# EAGLE design SmartLamp (EAGLE 7.7.0)
VERSION: 1.0
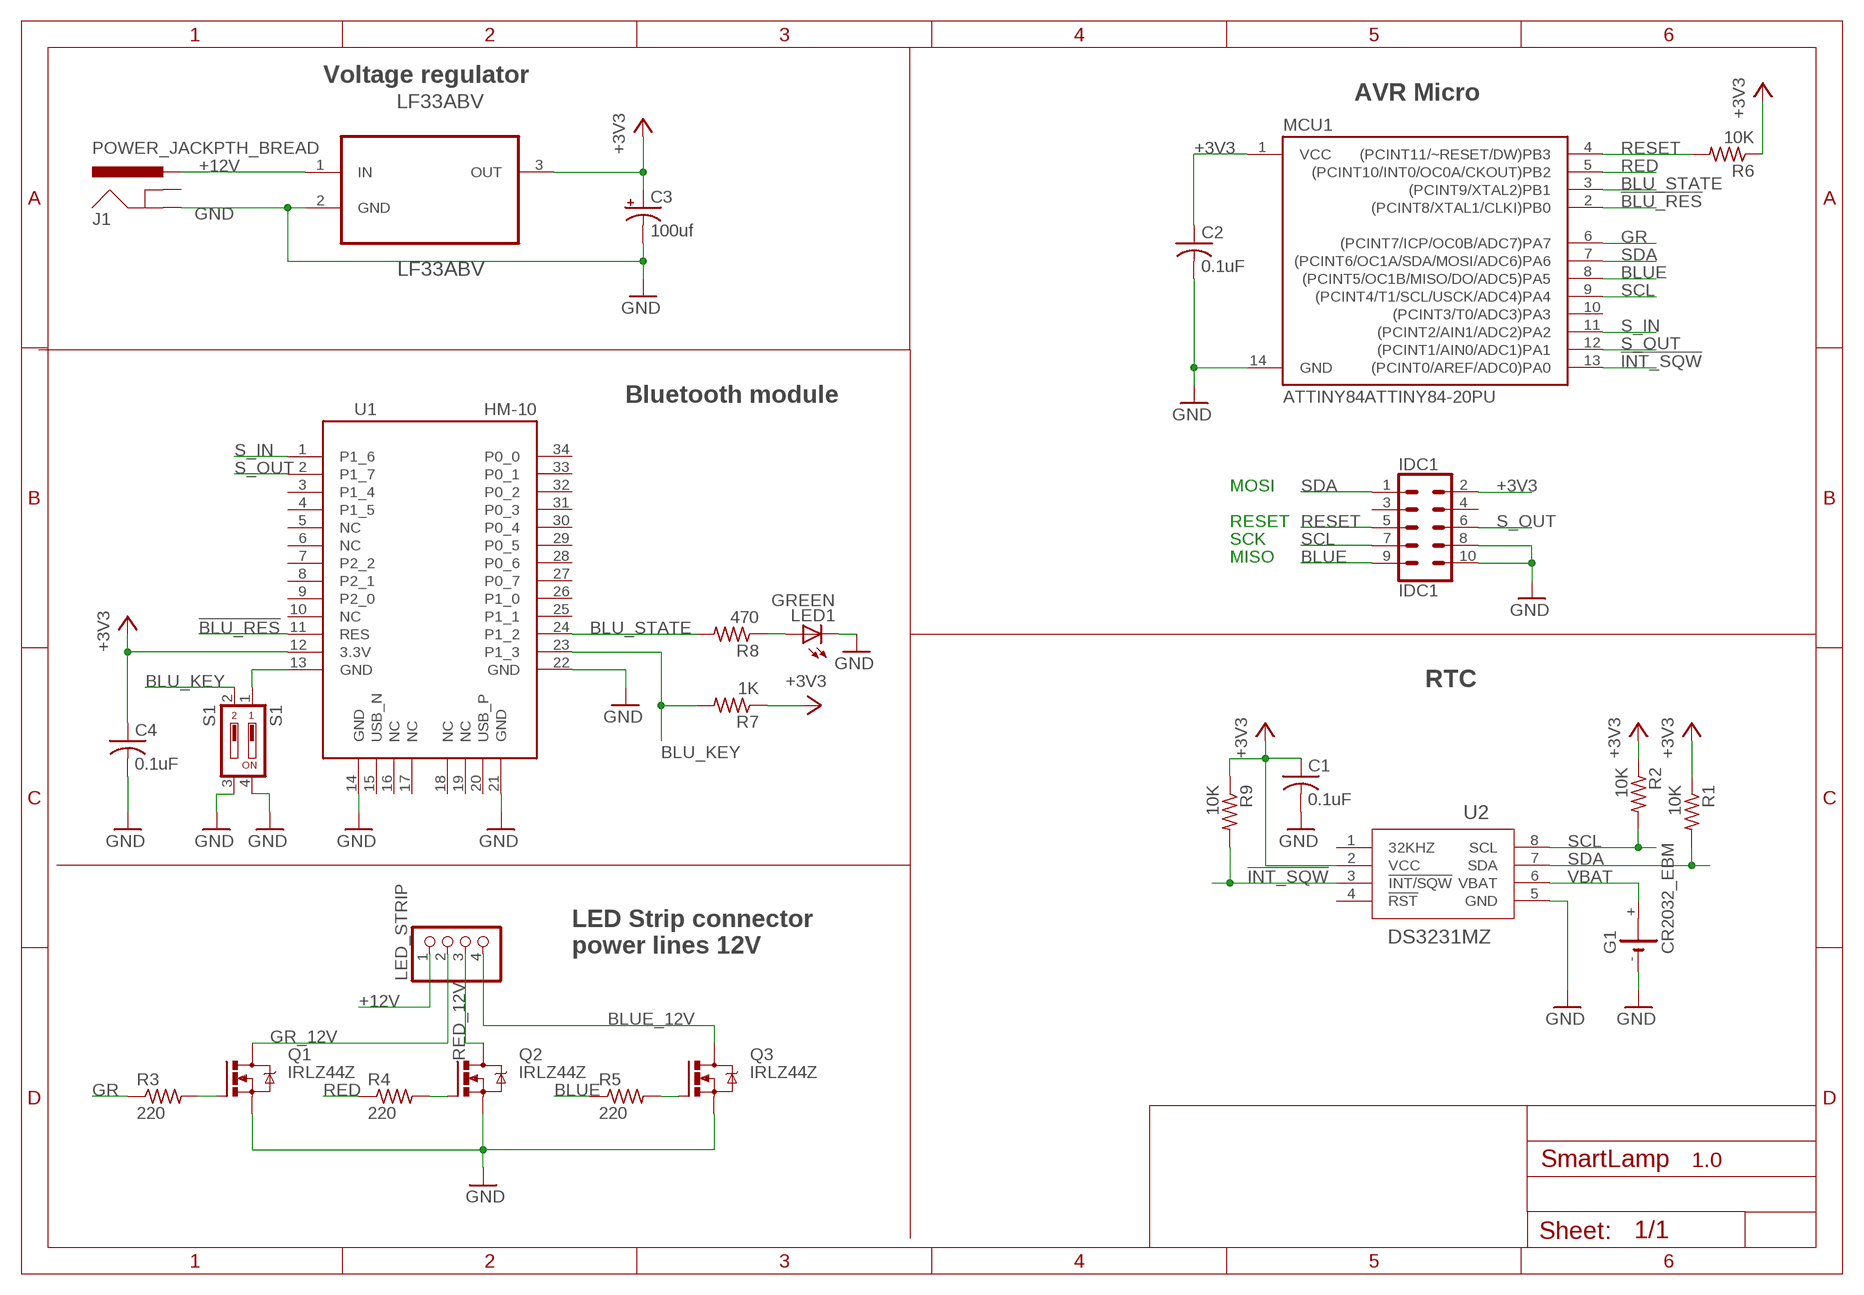
[diagram p0: schematic, sheet 1]

## Parts
C1  0.1uF  C-US025-024X044  [C025-024X044]
C2  0.1uF  C-US025-024X044  [C025-024X044]
C3  100uf  CAP_POLPTH2  [CPOL-RADIAL-10UF-25V]
C4  0.1uF  C-US025-024X044  [C025-024X044]
G1  CR2032_EBM  [CR2032_EBM]
IDC1  IDC1  CONN_05X2SHD  [2X5-SHROUDED]
J1  POWER_JACKPTH_BREAD  [POWER_JACK_PTH_BREAD]
LED1  GREEN  LED3MM  [LED3MM]
LED_STRIP  PINHD-1X4  [1X04]
LF33ABV  LF33ABV  [TO254P450X1020X1935-3P]
MCU1  ATTINY84ATTINY84-20PU  [DIL14]
Q1  IRLZ44Z  [TO220BH]
Q2  IRLZ44Z  [TO220BH]
Q3  IRLZ44Z  [TO220BH]
R1  10K  R-US_0309/12  [0309/12]
R2  10K  R-US_0309/12  [0309/12]
R3  220  R-US_0207/10  [0207/10]
R4  220  R-US_0207/10  [0207/10]
R5  220  R-US_0207/10  [0207/10]
R6  10K  R-US_0309/12  [0309/12]
R7  1K  R-US_0207/10  [0207/10]
R8  470  R-US_0309/12  [0309/12]
R9  10K  R-US_0309/12  [0309/12]
S1  S1  SD4-02  [SD4-02]
U1  HM-10  [HM-10]
U2  DS3231MZ  [21-0041B_8]

## Nets
!BLU_RES: MCU1.2((PCINT8/XTAL1/CLKI)PB0) U1.11(RES)
!INT_SQW: MCU1.13((PCINT0/AREF/ADC0)PA0) R9.2 U2.3(!INT/SQW)
+3V3 [3.3V]: C1.1 C2.1 C3.1(+) C4.1 IDC1.2 LF33ABV.3(OUT) MCU1.1(VCC) R1.1 R2.1 R6.1 R7.1 R9.1 U1.12(3.3V) U2.2(VCC)
+12V [POWER]: J1.PWR LED_STRIP.1 LF33ABV.1(IN)
BLU_KEY: R7.2 S1.2 U1.23(P1_3)
BLU_STATE: MCU1.3((PCINT9/XTAL2)PB1) R8.2 U1.24(P1_2)
BLU_SWITCH: S1.1 U1.13(GND)
BLUE: IDC1.9 MCU1.8((PCINT5/OC1B/MISO/DO/ADC5)PA5) R5.1
BLUE_12V [POWER]: LED_STRIP.4 Q3.D
GND [POWER]: C1.2 C2.2 C3.2(-) C4.2 G1.- IDC1.8 IDC1.10 J1.GND LED1.K(C) LF33ABV.2(GND) MCU1.14(GND) Q1.S Q2.S Q3.S S1.3 S1.4 U1.14(GND) U1.21(GND) U1.22(GND) U2.5(GND)
GR: MCU1.6((PCINT7/ICP/OC0B/ADC7)PA7) R3.1
GR_12V [POWER]: LED_STRIP.2 Q1.D
N$7: Q1.G R3.2
N$8: Q2.G R4.2
N$10: LED1.A R8.1
N$11: Q3.G R5.2
RED: MCU1.5((PCINT10/INT0/OC0A/CKOUT)PB2) R4.1
RED_12V [POWER]: LED_STRIP.3 Q2.D
RESET: IDC1.5 MCU1.4((PCINT11/~RESET/DW)PB3) R6.2
S_IN: MCU1.11((PCINT2/AIN1/ADC2)PA2) U1.1(P1_6)
S_OUT: IDC1.6 MCU1.12((PCINT1/AIN0/ADC1)PA1) U1.2(P1_7)
SCL: IDC1.7 MCU1.9((PCINT4/T1/SCL/USCK/ADC4)PA4) R2.2 U2.8(SCL)
SDA: IDC1.1 MCU1.7((PCINT6/OC1A/SDA/MOSI/ADC6)PA6) R1.2 U2.7(SDA)
VBAT: G1.+ U2.6(VBAT)
Unconnected: IDC1.3 IDC1.4 J1.GNDBREAK MCU1.10((PCINT3/T0/ADC3)PA3) U1.3(P1_4) U1.4(P1_5) U1.5(NC) U1.6(NC) U1.7(P2_2) U1.8(P2_1) U1.9(P2_0) U1.10(NC) U1.15(USB_N) U1.16(NC) U1.17(NC) U1.18(NC) U1.19(NC) U1.20(USB_P) U1.25(P1_1) U1.26(P1_0) U1.27(P0_7) U1.28(P0_6) U1.29(P0_5) U1.30(P0_4) U1.31(P0_3) U1.32(P0_2) U1.33(P0_1) U1.34(P0_0) U2.1(32KHZ) U2.4(!RST)

## Notes on the sheet
- Voltage regulator
- AVR Micro
- Bluetooth module
- MOSI
- RESET
- SCK
- MISO
- RTC
- LED Strip connector
  power lines 12V

## Library data of the parts
C1 C2 C4 = adafruit:C-US: CAPACITOR, American symbol
C3 = SparkFun-Capacitors:CAP_POL: Capacitor Polarized These are standard SMD and PTH capacitors. Normally 10uF, 47uF, and 100uF in electrolytic and tantalum varieties. Always verify the external diameter of the through hole cap, it varies with capacity, voltage, and manufacturer. The EIA devices should be standard.
G1 = CuSTOM_GB:CR2032_EBM: Battery holder CR2032 from EbmStore
IDC1 = SparkFun-Connectors:CONN_05X2: Multi connection point. Often used as Generic Header-pin footprint for 0.1 inch spaced/style header connections For AVR SPI programming port, see special device with nice symbol: "AVR_SPI_PROG_5x2.dev" You can populate with any combo of single row headers, but if you'd like an exact match, check these: 2x5 AVR ICSP Male Header <https://www.sparkfun.com/products/778> (PRT-00778) 2x5 Pin Shrouded Header <https://www.sparkfun.com/products/8506> (PRT-08506) On any of the 0.1 inch spaced packages, you can populate with these: Break Away Headers - Straight <https://www.sparkfun.com/products/116> (PRT-00116) Break Away Male Headers - Right Angle <https://www.sparkfun.com/products/553> (PRT-00553) Female Headers <https://www.sparkfun.com/products/115> (PRT-00115) Break Away Headers - Machine Pin <https://www.sparkfun.com/products/117> (PRT-00117) Break Away Female Headers - Swiss Machine Pin <https://www.sparkfun.com/products/743> (PRT-00743) Special note: the shrouded connector mates well with our 5x2 ribbon cables: 2x5 Pin IDC Ribbon Cable <https://www.sparkfun.com/products/8535> (PRT-08535); PROD_ID: CONN-08671; SF_ID: PRT-08506
J1 = SparkFun-Connectors:POWER_JACK: Power Jack Connector This is the standard 5.5mm barrel jack for power. The PTH is the most common, proven, reliable, footprint. The Slot footprint only works if the mill layer is transmitted to the PCB fab house so be warned. Here are the connectors we sell at SparkFun: DC Barrel Power Jack/Connector <https://www.sparkfun.com/products/119> (PRT-00119) DC Barrel Power Jack/Connector (SMD) <https://www.sparkfun.com/products/12748> (PRT-12748) DC Barrel Jack Adapter - Breadboard Compatible <https://www.sparkfun.com/products/10811> (PRT-10811) It is used on this SparkFun product (and many, many others): SparkFun RedBoard - Programmed with Arduino <https://www.sparkfun.com/products/12757> (DEV-12757) Also, if you need a mating power supply or connector, please check these out: Wall Adapter Power Supply - 9VDC 650mA <https://www.sparkfun.com/products/298> (TOL-00298) DC Barrel Jack Adapter - Male <https://www.sparkfun.com/products/10287> (PRT-10287); PROD_ID: PRT-10811
LED1 = adafruit:LED: LED OSRAM: - CHIPLED LG R971, LG N971, LY N971, LG Q971, LY Q971, LO R971, LY R971 LH N974, LH R974 LS Q976, LO Q976, LY Q976 LO Q996 - Hyper CHIPLED LW Q18S LB Q993, LB Q99A, LB R99A - SideLED LS A670, LO A670, LY A670, LG A670, LP A670 LB A673, LV A673, LT A673, LW A673 LH A674 LY A675 LS A676, LA A676, LO A676, LY A676, LW A676 LS A679, LY A679, LG A679 - Hyper Micro SIDELED® LS Y876, LA Y876, LO Y876, LY Y876 LT Y87S - SmartLED LW L88C, LW L88S LB L89C, LB L89S, LG L890 LS L89K, LO L89K, LY L89K LS L896, LA L896, LO L896, LY L896 - TOPLED LS T670, LO T670, LY T670, LG T670, LP T670 LSG T670, LSP T670, LSY T670, LOP T670, LYG T670 LG T671, LOG T671, LSG T671 LB T673, LV T673, LT T673, LW T673 LH T674 LS T676, LA T676, LO T676, LY T676, LB T676, LH T676, LSB T676, LW T676 LB T67C, LV T67C, LT T67C, LS T67K, LO T67K, LY T67K, LW E67C LS E67B, LA E67B, LO E67B, LY E67B, LB E67C, LV E67C, LT E67C LW T67C LS T679, LY T679, LG T679 LS T770, LO T770, LY T770, LG T770, LP T770 LB T773, LV T773, LT T773, LW T773 LH T774 LS E675, LA E675, LY E675, LS T675 LS T776, LA T776, LO T776, LY T776, LB T776 LHGB T686 LT T68C, LB T68C - Hyper Mini TOPLED® LB M676 - Mini TOPLED Santana® LG M470 LS M47K, LO M47K, LY M47K Source: http://www.osram.convergy.de/
LED_STRIP = pinhead:PINHD-1X4: PIN HEADER
LF33ABV = ST Microelctronics_By_element14_Batch_1:LF33ABV: Very low drop voltage regulators with inhibit; MPN: LF33ABV; OC_FARNELL: 1087184; OC_NEWARK: 26M0228; PACKAGE: TO-220; SUPPLIER: STMicroelectronics
MCU1 = SparkFun-DigitalIC:ATTINY84: Atmel 14-pin 2/4/8kB flash uC
Q1-Q3 = transistor-power:IRLZ44Z: N-Channel HEXFET® Power MOSFET Logic Level AUTOMOTIVE MOSFET Source: http://www.irf.com/product-info/datasheets/data/irlz44zpbf.pdf
R1-R9 = rcl:R-US_: RESISTOR, American symbol
S1 = switch-dil:SD4-02: DIL/CODE SWITCH; OC_FARNELL: unknown; OC_NEWARK: unknown
U1 = HM-10_BLE:HM-10
U2 = Maxim_RTC:DS3231MZ; MANUFACTURER_PART_NUMBER: DS3231MZ; VENDOR: MAXIM

## Net classes
1 POWER: width 0.762 mm, drill 0.508 mm, clearance 0.381 mm
2 3.3V: width 0.127 mm, drill 0.127 mm, clearance 0.254 mm

## Board
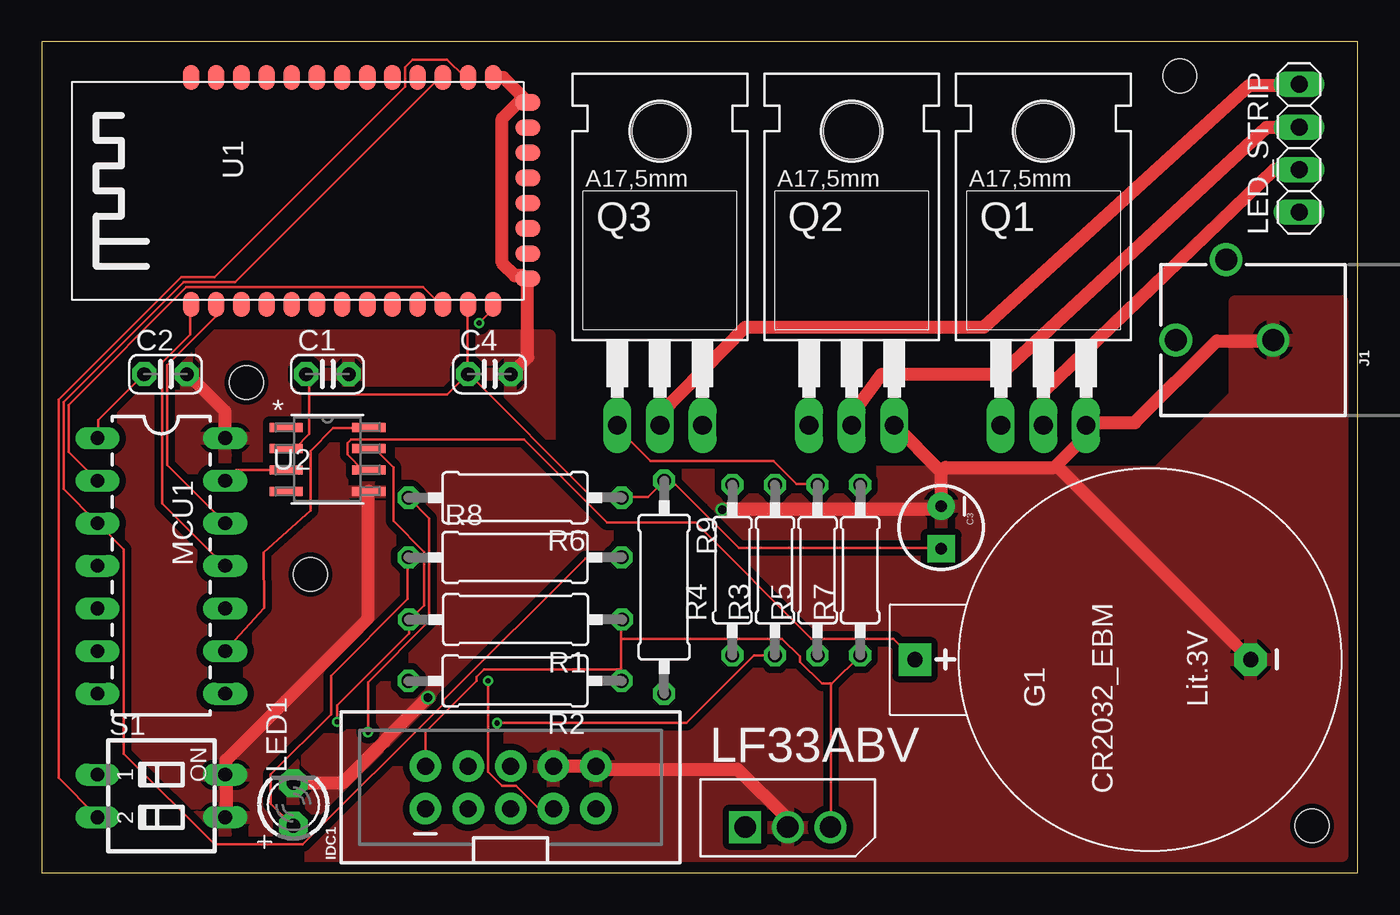
[diagram p1: board, top side]
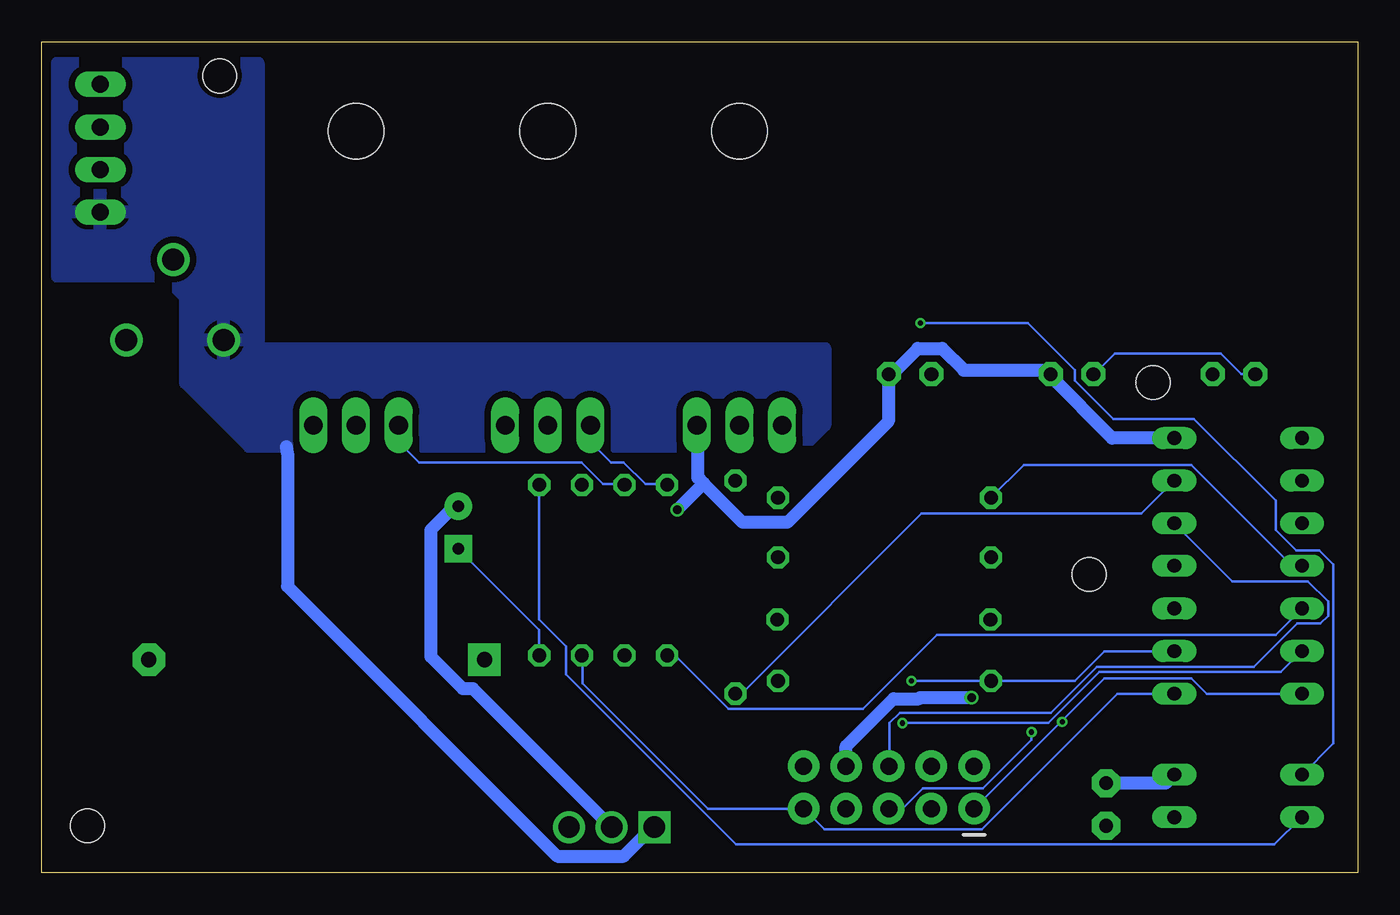
[diagram p2: board, bottom side, seen from below]

Size 78.41 x 49.52 mm. Coordinates in mm from the lower left corner, seen from the top.
Outline: 0,0 78.41,0 78.41,49.52 0,49.52 0,0
Copper layers (1*16): Top 0.035mm / dielectric 1.5mm / Bottom 0.035mm
Design rules "SeeedStudio_2layer_DRU_no_angle_20140221": minimum track width 6mil, minimum drill 12mil, track to track 6mil, track to pad 6mil, pad to pad 6mil, via to via 6mil, smd to smd 0mil, copper to edge 10mil, drill to drill 10mil, minimum pad ring 10mil, minimum via ring 6mil, stop-mask expansion 2mil, vias tented up to drill 100mil, thermal gap 10mil
Holes 2 mm at 75.69,2.79 12.19,29.21 67.82,47.5 16,17.78

### Footprints (pad centres in the part's own frame; a part is rotated, then mirrored left to right if it is on the bottom)
C025-024X044 = drill 0.813 pad 1.422 octagon: 1 -1.27,0; 2 1.27,0
CPOL-RADIAL-10UF-25V = drill 0.7 pad 1.651 square: 1 1.27,0 | drill 0.7 pad 1.651: 2 -1.27,0
CR2032_EBM = drill 0.9 pad 1.93 square: + 0,14 | drill 0.9 pad 1.93 octagon: - 0,-6
2X5-SHROUDED = drill 1.016 pad 1.88: 1 -1.27,5.08; 2 1.27,5.08; 3 -1.27,2.54; 4 1.27,2.54; 5 -1.27,0; 6 1.27,0; 7 -1.27,-2.54; 8 1.27,-2.54; 9 -1.27,-5.08; 10 1.27,-5.08
POWER_JACK_PTH_BREAD = drill 1.3: GND 0,7.9; GNDBREAK 4.8,10.7; PWR 0,13.7
LED3MM = drill 0.813 pad 1.676 octagon: A -1.27,0; K 1.27,0
1X04 = drill 1.016 long: 1 -3.81,0; 2 -1.27,0; 3 1.27,0; 4 3.81,0
TO254P450X1020X1935-3P = drill 1.27 square: 1 -5.08,-1.092 | drill 1.27: 2 -2.54,-1.092; 3 0,-1.092
DIL14 = drill 0.813 long: 1 -8.89,-3.81; 2 -6.35,-3.81; 3 -3.81,-3.81; 4 -1.27,-3.81; 5 1.27,-3.81; 6 3.81,-3.81; 7 6.35,-3.81; 8 6.35,3.81; 9 3.81,3.81; 10 1.27,3.81; 11 -1.27,3.81; 12 -3.81,3.81; 13 -6.35,3.81; 14 -8.89,3.81
TO220BH = drill 1.118 long: D 0,-6.35; G -2.54,-6.35; S 2.54,-6.35 | hole 3.302: 0,11.176
0309/12 = drill 0.813 octagon: 1 -6.35,0; 2 6.35,0
0207/10 = drill 0.813 octagon: 1 -5.08,0; 2 5.08,0
SD4-02 = drill 0.813 long: 1 -1.27,-3.81; 2 1.27,-3.81; 3 1.27,3.81; 4 -1.27,3.81
HM-10 = smd 1.5 x 1: 1 -6.77,6.35; 2 -6.77,4.85; 3 -6.77,3.35; 4 -6.77,1.85; 5 -6.77,0.35; 6 -6.77,-1.15; 7 -6.77,-2.65; 8 -6.77,-4.15; 9 -6.77,-5.65; 10 -6.77,-7.15; 11 -6.77,-8.65; 12 -6.77,-10.15; 13 -6.77,-11.65; 22 6.77,-11.65; 23 6.77,-10.15; 24 6.77,-8.65; 25 6.77,-7.15; 26 6.77,-5.65; 27 6.77,-4.15; 28 6.77,-2.65; 29 6.77,-1.15; 30 6.77,0.35; 31 6.77,1.85; 32 6.77,3.35; 33 6.77,4.85; 34 6.77,6.35 | smd 1 x 1.5: 14 -5.23,-13.72; 15 -3.73,-13.72; 16 -2.23,-13.72; 17 -0.73,-13.72; 18 0.77,-13.72; 19 2.27,-13.72; 20 3.77,-13.72; 21 5.27,-13.72
21-0041B_8 = smd 1.981 x 0.533: 1 -2.464,1.905; 2 -2.464,0.635; 3 -2.464,-0.635; 4 -2.464,-1.905; 5 2.464,-1.905; 6 2.464,-0.635; 7 2.464,0.635; 8 2.464,1.905

### Placement (x,y rotation side)
C1  17.02,29.72 0 top
C2  7.37,29.72 0 top
C3  53.59,20.57 270 top
C4  26.67,29.72 0 top
G1  66.04,12.7 90 top
IDC1  27.94,5.08 90 top
J1  81.28,31.75 90 top
LED1  14.99,4.06 90 top
LED_STRIP  74.93,43.18 90 top
LF33ABV  46.99,3.81 0 top
MCU1  7.11,17.02 270 top
Q1  59.69,33.02 0 top
Q2  48.26,33.02 0 top
Q3  36.83,33.02 0 top
R1  28.23,15.09 180 top
R2  28.19,11.43 180 top
R3  43.69,18.03 90 top
R4  41.15,18.03 90 top
R5  46.23,18.03 90 top
R6  28.19,22.35 180 top
R7  48.77,18.03 90 top
R8  28.19,18.8 0 top
R9  37.08,17.02 270 top
S1  7.11,4.57 270 top
U1  15.24,40.64 90 top
U2  17.02,24.64 0 top

### Tracks (layer width: path | path; a pad name or v marks a point on that pad's centre or on a via)
!BLU_RES
  Top 0.152: MCU1.2 1.6,25.07 1.6,27.89 8.61,34.9 22.71,34.9 23.7,33.91 23.85,33.91 U1.11
!INT_SQW
  Top 0.152: U2.3 11.58,24 10.97,23.39 MCU1.13
  Bottom 0.152: R9.2 36.73,10.67 25.98,21.41 12.88,21.41 MCU1.13
+3V3
  Top 0.152: C2.1 3.35,26.98 3.35,25.91 MCU1.1 | 15.93,28.5 15.93,29.57 15.77,29.72 C1.1 | 15.93,28.5 15.93,26.14 15.09,25.3 14.55,25.3 U2.2 | 25.38,29.72 25.38,33.83 U1.12 | 15.93,28.5 24.16,28.5 25.38,29.72 | 25.38,29.72 C4.1 25.45,29.72 32.77,22.4 34.52,22.4 R6.1 34.59,22.4 36.12,22.4 R9.1 37.11,23.32 37.57,23.32 41.53,19.36 53.57,19.36 C3.1 | 34.52,13.95 34.52,15.09 R1.1 | 34.52,13.95 34.52,12.12 | 34.52,12.12 34.52,11.43 R2.1 | IDC1.2 22.86,8.38 25.91,11.43 25.91,11.66 26.36,12.12 34.52,12.12 | R7.1 47.05,11.24 | 47.05,11.24 47.02,11.2 47.02,2.74 LF33ABV.3 | 34.52,13.95 44.12,13.95 45.19,12.88 45.19,12.57 46.48,11.28 47.02,11.28 47.05,11.24
  Bottom 0.152: C2.1 6.93,29.72 8.15,30.94 14.48,30.94 15.7,29.72 C1.1 | R7.1 48.77,14.48 C3.1
+12V
  Bottom 0.762: LF33ABV.1 41.91,2.67 42.06,2.67 43.74,0.99 47.7,0.99 63.78,17.07 63.78,24.99 63.84,25.4
  pour Bottom (isolate 0.305): 65.53,31.24 31.75,31.24 31.75,26.67 33.02,25.4 66.04,25.4 69.85,29.21 69.85,34.29 71.12,35.56 77.47,35.56 77.47,48.26 65.53,48.26
BLU_KEY
  Top 0.152: U1.23 25.38,47.47 25.15,47.47 24.16,48.46 22.1,48.46 21.64,48.01 21.64,46.86 10.29,35.51 8.31,35.51 0.99,28.19 0.99,5.64 3.28,3.35 S1.2
  Bottom 0.152: R7.2 48.77,15.09 47.17,13.49 47.17,11.81 37.03,1.68 4.95,1.68 3.35,3.28 S1.2
BLU_STATE
  Top 0.152: U1.24 23.85,47.4 23.7,47.4 11.51,35.2 8.46,35.2 1.29,28.04 1.29,22.86 3.28,20.88 MCU1.3 3.35,20.8 4.88,19.28 4.88,7.09 10.29,1.68 15.54,1.68 23.93,10.06 23.93,10.29 32.38,18.75 34.52,18.75 R8.2
BLU_SWITCH  (via drill 0.3)
  Top 0.152: v26.06,32.77 26.82,33.53 26.82,33.83 U1.13
  Bottom 0.152: v26.06,32.77 19.66,32.77 16.84,29.95 16.84,29.34 14.55,27.05 9.75,27.05 4.88,22.17 4.88,20.42 3.66,19.2 2.29,19.2 1.45,18.36 1.45,7.7 S1.1
BLUE
  Bottom 0.152: MCU1.8 14.33,10.67 22.4,2.59 31.77,2.59 32.99,3.81 IDC1.9 38.71,3.81 46.18,11.28 46.18,12.95 R5.1
BLUE_12V
  Top 0.762: LED_STRIP.4 74.91,46.94 71.96,46.94 56.13,32.51 41.91,32.51 36.88,27.36 36.88,26.67 Q3.D
GND  (via drill 0.51)
  Top 0.762: MCU1.14 10.9,25.91 10.9,27.51 8.69,29.72 C2.2 | U1.22 26.9,47.4 27.51,47.4 28.96,45.95 U1.21 28.42,45.95 27.43,44.96 27.43,36.35 28.19,35.59 28.65,35.59 U1.14 28.96,35.36 28.96,30.71 27.96,29.72 C4.2 | U2.5 19.43,22.71 19.43,15.16 10.97,6.71 10.97,5.87 S1.4 10.97,5.49 10.97,3.35 S1.3 | IDC1.8 30.48,6.33 32.99,6.33 IDC1.10 33.38,6.17 41.45,6.17 44.42,3.2 44.42,2.74 LF33ABV.2 | 53.57,23.93 53.57,21.87 C3.2 53.26,21.64 v40.54,21.64 | 53.57,23.93 50.83,26.67 Q2.S | 60.47,24.27 60.35,24.16 53.87,24.16 53.57,23.93 | 60.47,24.27 62.18,25.98 62.18,26.67 Q1.S 62.56,26.82 65.15,26.82 70.03,31.7 73.3,31.7 J1.GND | 60.47,24.27 72.01,12.72 G1.- | LED1.K 17.91,5.33 v23.01,10.44
  Bottom 0.762: MCU1.14 14.63,25.91 18.29,29.57 C1.2 18.59,29.95 23.47,29.95 24.77,31.24 26.21,31.24 27.58,29.87 C4.2 27.96,29.72 27.96,26.9 33.98,20.88 36.65,20.88 38.98,23.2 | 38.98,23.2 39.32,23.55 39.32,26.67 Q3.S | LED1.K 11.43,5.33 S1.4 | LF33ABV.2 44.5,2.74 52.73,10.97 53.34,10.97 55.24,12.88 55.24,20.42 53.87,21.79 53.65,21.79 C3.2 | v23.01,10.44 26.06,10.44 26.14,10.36 27.66,10.36 30.48,7.54 IDC1.8 | v40.54,21.64 38.98,23.2
  pour Top (isolate 0.305): 1.02,32 30.23,32 30.23,25.15 31.5,23.88 32,23.88 66.55,23.88 71.12,28.45 71.12,34.04 77.47,34.04 77.47,1.02 1.27,1.02 1.02,1.27
GR  (via drill 0.3)
  Top 0.152: R3.1 42.44,12.95 38.41,8.91 v27.13,8.91
  Bottom 0.152: v27.13,8.91 18.44,8.91 15.39,11.96 4.57,11.96 3.35,13.18 MCU1.6
GR_12V
  Top 0.762: LED_STRIP.2 73.46,41.91 59.74,28.7 59.69,28.7 Q1.D
N$7
  Bottom 0.152: Q1.G 57.15,25.68 55.93,24.46 46.25,24.46 44.96,23.16 43.74,23.16 R3.2
N$8
  Bottom 0.152: Q2.G 45.72,25.68 44.5,24.46 43.74,24.46 42.44,23.16 41.15,23.16 R4.2
N$10
  Top 0.152: R8.1 21.79,18.75 21.79,16.31 17.22,11.73 17.22,9.45 13.64,5.87 13.64,4.12 14.94,2.82 LED1.A
N$11
  Top 0.152: Q3.G 34.29,26.52 36.27,24.54 43.59,24.54 44.96,23.16 46.18,23.16 R5.2
RED
  Bottom 0.152: R4.1 40.69,12.95 37.49,9.75 29.49,9.75 25.07,14.17 4.88,14.17 MCU1.5
RED_12V
  Top 0.762: LED_STRIP.3 74.91,44.42 73,44.42 57.15,29.72 50.04,29.72 48.31,27.36 48.31,26.67 Q2.D
RESET  (via drill 0.3)
  Top 0.152: v19.43,8.38 19.43,11.35 23.09,15.01 23.09,21.11 R6.2
  Bottom 0.152: MCU1.4 3.89,18.29 9.91,24.31 19.89,24.31 R6.2 | IDC1.5 27.13,3.81 25.91,5.03 22.33,5.03 19.43,7.92 v19.43,8.38
S_IN
  Top 0.152: U1.1 8.84,33.83 8.84,32.08 7.16,30.4 7.16,22.02 10.9,18.29 MCU1.11
S_OUT
  Top 0.152: U1.2 10.36,33.83 10.36,33.15 7.47,30.25 7.47,24.31 10.9,20.88 MCU1.12
  Bottom 0.152: MCU1.12 7.47,17.37 2.97,17.37 1.75,16.15 1.75,15.32 2.21,14.86 3.58,14.86 6.17,12.27 15.54,12.27 18.29,9.53 27.28,9.53 27.89,8.91 27.89,6.4 IDC1.6
SCL  (via drill 0.3)
  Top 0.152: MCU1.9 13.23,15.77 13.21,19.07 16,21.59 16,25.15 17.35,26.52 19.43,26.52 U2.8 | IDC1.7 29.64,3.81 28.27,5.18 27.43,5.18 26.59,6.02 v26.59,11.43
  Bottom 0.152: MCU1.9 10.97,13.18 15.09,13.18 16.84,11.43 R2.2 v26.59,11.43
SDA  (via drill 0.3)
  Top 0.152: U2.7 19.51,25.22 19.89,25.22 20.95,24.16 20.95,20.95 22.78,19.13 22.78,15.93 21.95,15.09 R1.2 21.87,14.25 17.6,9.98 v17.6,8.99
  Bottom 0.152: MCU1.7 8.99,10.67 9.91,11.58 15.09,11.58 17.64,9.03 | IDC1.1 17.64,9.03 | v17.6,8.99 17.64,9.03
VBAT
  Top 0.152: U2.6 19.13,24 18.21,24.92 18.21,25.6 18.44,25.83 28.73,25.83 33.68,20.88 38.94,20.88 45.87,13.95 50.75,13.95 51.97,12.72 G1.+

### Text on the board
Document: BLUE | RED | GREEN | +12V | +3.3V | +3.3V | +3.3V | S_OUT | BLU_KEY | BLU_SWITCH | MOSI | RESET | SCK | MISO | SmartLamp v1.0